# EAGLE design UPC v4 (EAGLE 7.6.0)
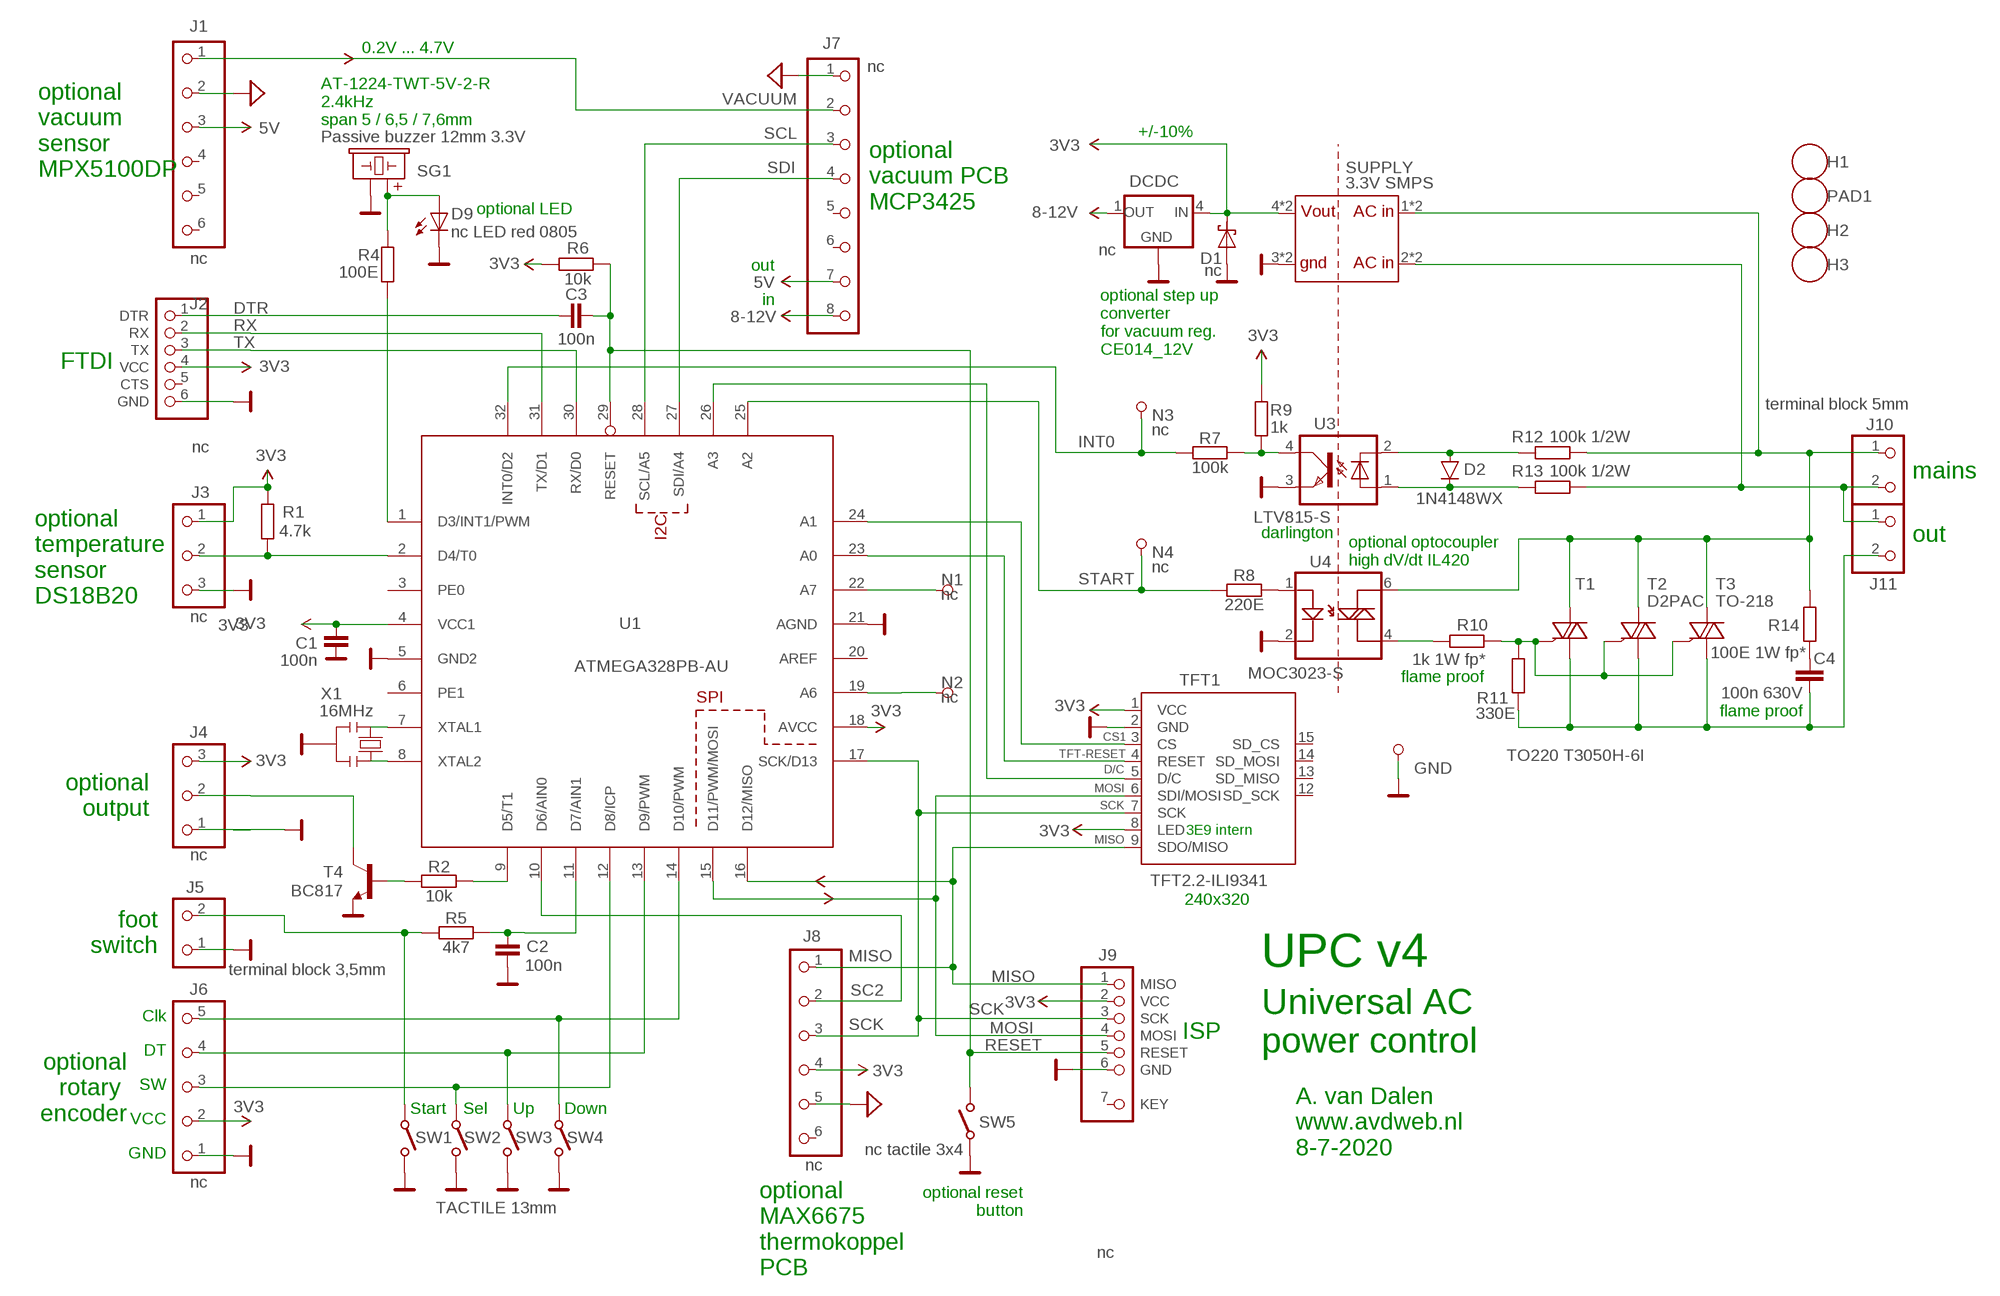
[diagram p0: schematic, sheet 1]
V1 (ARROW): VALUE: x
V2 (ARROW): VALUE: x
V3 (ARROW): VALUE: x
V4 (ARROW): VALUE: x
V5 (ARROW): VALUE: x
V6 (ARROW): VALUE: x
V7 (ARROW): VALUE: x
V8 (ARROW): VALUE: x
V9 (ARROW): VALUE: x
V10 (ARROW): VALUE: x
V11 (ARROW): VALUE: x
V12 (ARROW): VALUE: x
V13 (ARROW): VALUE: x
V14 (ARROW): VALUE: x
V15 (ARROW): VALUE: x
V16 (ARROW): VALUE: x
V17 (ARROW): VALUE: x
V18 (ARROW): VALUE: x
V19 (ARROW): VALUE: x
V20 (ARROW): VALUE: x

## Parts
C1  100n  SMD-C-0603-SMALL  [0603-SMALL]
C2  100n  SMD-C-0603-SMALL  [0603-SMALL]
C3  100n  SMD-C-0603-SMALL  [0603-SMALL]
C4  100n 630V  CAPX2  [C15B6]
D1  nc  TVS-DO-214AC  [DO-214AC]
D2  1N4148WX  DIODE-SMD  [SOD-323]
D9  nc LED red 0805  LEDCHIP-LED0805  [CHIP-LED0805]
DCDC  nc  78REGCE014-SMPS  [1X04-ACDC]
GND  GND  PIN  [PIN]
H1  HOLE3.6  [HOLE-3.6MM]
H2  HOLE3.6  [HOLE-3.6MM]
H3  HOLE3.6  [HOLE-3.6MM]
J1  nc  VACUUM-SENSORMPX5100  [MPX5100-VACUUM-SENSOR]
J2  nc  FTDI  [ZIGZAG-FTDI]
J3  nc  CON-3P2.54  [1X03]
J4  nc  CON-3P2.54  [1X03]
J5  terminal block 3,5mm  CON-2PSCR1  [SCREWTERMINAL-3.5MM-2]
J6  nc  CON-5PHEADER  [1X05]
J7  nc  CON-8P2,54  [1X08]
J8  nc  CON-6PISP-BOARD  [1X06-ISP-BOARD]
J9  nc  ISP'  [ZIGZAG-ISP]
J10  Terminal block 5mm 2p  CON-2PSCR2  [SCREWTERMINAL-5MM-2]
J11  terminal block 5mm  CON-2PSCR2  [SCREWTERMINAL-5MM-2]
N1  nc  PIN1.2MM  [PIN-1.2MM]
N2  nc  PIN1.2MM  [PIN-1.2MM]
N3  nc  PIN1.2MM  [PIN-1.2MM]
N4  nc  PIN1.2MM  [PIN-1.2MM]
PAD1  HOLE3.6  [HOLE-3.6MM]
R1  4.7k  SMD-R-0603-SMALL  [0603-SMALL]
R2  10k  SMD-R-0603-SMALL  [0603-SMALL]
R4  100E  SMD-R-0603-SMALL  [0603-SMALL]
R5  4k7  SMD-R-0603-SMALL  [0603-SMALL]
R6  10k  SMD-R-0603-SMALL  [0603-SMALL]
R7  100k  SMD-R-0603-SMALL  [0603-SMALL]
R8  220E  SMD-R-0603-SMALL  [0603-SMALL]
R9  1k  SMD-R-0603-SMALL  [0603-SMALL]
R10  1k 1W fp*  SMD-R-POWER  [0411/15_AVD]
R11  330E  SMD-R-0603-SMALL  [0603-SMALL]
R12  100k 1/2W  R-EU_M1206  [M1206]
R13  100k 1/2W  R-EU_M1206  [M1206]
R14  100E 1W fp*  SMD-R-POWER  [0411/15_AVD]
SG1  Passive buzzer 12mm 3.3V  BUZZER  [BUZZER-12MM-NS-KIT]
SUPPLY  3.3V SMPS  SMPSSMPS2  [SMPS2]
SW1  TACTILE 13mm  TACTILE  [TACTILE-PTH]
SW2  TACTILE 13mm  TACTILE  [TACTILE-PTH]
SW3  TACTILE 13mm  TACTILE  [TACTILE-PTH]
SW4  TACTILE 13mm  TACTILE  [TACTILE-PTH]
SW5  nc tactile 3x4  TACTILE"  [TACTILE-3X4]
T1  TO220 T3050H-6I  TRIACTO220  [TO220-SPOTWELDER]
T2  D2PAC  TRIACSMD  [D2PACK-SPOTWELDER-NO-CREAM]
T3  TO-218  TRIAC218  [TO218-SPOTWELDER]
T4  BC817  TRANSISTOR_NPNSOT23-3  [SOT23-3]
TFT1  TFT2.2-ILI9341  TFT2.2-9P9P  [TFT2.2-9P]
U1  ATMEGA328PB-AU  ATMEGA328PB-TQFP*  [TQFP32-08]
U3  LTV815-S  LTV816SMD  [DIL4-SMD]
U4  MOC3023-S  MOC3032-S  [DIL6-SMD-WIDE]
X1  16MHz  0011_CSTCE16M0V53-R0  [RESONATOR]

## Nets
3V3: C1.2 D1.C DCDC.4(IN) J2.4(VCC) J3.1 J4.3 J6.2 J8.4 J9.2(VCC) R1.1 R6.2 R9.2 SUPPLY.4(5V) SUPPLY.7(5V) TFT1.1(VCC) TFT1.8(LED) U1.4(VCC1) U1.18(AVCC)
5V: J1.3 J7.7
8-12V: DCDC.1(OUT) J7.8
AGND: J1.2 J7.1 J8.5
BUZZER: R4.2 U1.1(D3/INT1/PWM)
BUZZER+: D9.A R4.1 SG1.+1(+) SG1.+2(+)
CS1: TFT1.3(CS) U1.24(A1)
D/C: TFT1.5(D/C) U1.26(A3)
DOWN: J6.3 SW2.3(P) SW2.4(P) U1.12(D8/ICP)
DTR: C3.1 J2.1(DTR)
FOOT1: J5.2 R5.1 SW1.3(P) SW1.4(P)
FOOT2: C2.2 R5.2 U1.11(D7/AIN1)
GND: C1.1 C2.1 D1.A D9.C DCDC.2(GND) DCDC.3(GND) GND.1 J2.6(GND) J3.3 J4.1 J5.1 J6.1 J9.6(GND) SG1.-1(-) SG1.-2(-) SUPPLY.3(GND) SUPPLY.5(GND) SW1.1(O) SW1.2(O) SW2.1(O) SW2.2(O) SW3.1(O) SW3.2(O) SW4.1(O) SW4.2(O) SW5.2(P) T4.2(E) TFT1.2(GND) U1.5(GND2) U1.21(AGND) U3.3(EMIT) U4.2 X1.2 ; supply symbol labelled GND2
INT0: N3.1 R7.1 U1.32(INT0/D2)
MAINS1 [PWR]: J10.2 J11.1 R13.2 SUPPLY.2(AC2) SUPPLY.8(AC2)
MAINS2: J10.1 R12.2 R14.2 SUPPLY.1(AC1) SUPPLY.9(AC1) T1.2(A2) T2.TAB(A2) T3.2(A2) U4.6
MISO: J8.1 J9.1(MISO) TFT1.9(SDO/MISO) U1.16(D12/MISO)
MOSI: J9.4(MOSI) TFT1.6(SDI/MOSI) U1.15(D11/PWM/MOSI)
N$1: R10.1 U4.4
N$2: R2.1 T4.1(B)
N$3: N2.1 U1.19(A6)
N$4: N1.1 U1.22(A7)
N$5: R8.2 U4.1
N$6: D2.A R12.1 U3.2(C)
N$7: D2.C R13.1 U3.1(A)
N$8: U1.7(XTAL1) X1.1
N$9: C4.1 R14.1
N$10: J4.2 T4.3(C)
N$11: R2.2 U1.9(D5/T1)
N$13: R7.2 R9.1 U3.4(COL)
N$17: U1.8(XTAL2) X1.3
Q1-C: C4.2 C4.3 J11.2 R11.1 T1.1(A1) T2.1(A1) T3.1(A1)
Q1-G: R10.2 R11.2 T1.3(G) T2.3(G) T3.3(G)
RESET: C3.2 J9.5(RESET) R6.1 SW5.1(O) U1.29(RESET)
RX: J2.2(RX) U1.31(TX/D1)
SC2: J8.2 U1.10(D6/AIN0)
SCK: J8.3 J9.3(SCK) TFT1.7(SCK) U1.17(SCK/D13)
SCL: J7.3 U1.28(SCL/A5)
SDI: J7.4 U1.27(SDI/A4)
SEL: J6.5 SW4.3(P) SW4.4(P) U1.14(D10/PWM)
START: N4.1 R8.1 U1.25(A2)
TEMP: J3.2 R1.2 U1.2(D4/T0)
TFT-RESET: TFT1.4(RESET) U1.23(A0)
TX: J2.3(TX) U1.30(RX/D0)
UP: J6.4 SW3.3(P) SW3.4(P) U1.13(D9/PWM)
VACUUM: J1.1 J7.2
Unconnected: J1.4 J1.5 J1.6 J2.5(CTS) J7.5 J7.6 J8.6 J9.7(KEY) TFT1.12(SD_SCK) TFT1.13(SD_MISO) TFT1.14(SD_MOSI) TFT1.15(SD_CS) U1.3(PE0) U1.6(PE1) U1.20(AREF)

## Notes on the sheet
- 0.2V ... 4.7V
- AT-1224-TWT-5V-2-R
  2.4kHz
  span 5 / 6,5 / 7,6mm
- +/-10%
- optional
  vacuum 
  sensor
  MPX5100DP
- optional LED
- optional
  vacuum PCB
  MCP3425
- out
- in
- optional step up
  converter
  for vacuum reg.
  CE014_12V
- FTDI
- mains
- darlington | out
- optional optocoupler
  high dV/dt IL420
- optional
  temperature 
  sensor
  DS18B20
- flame proof
- flame proof
- optional
  output
- 3E9 intern
- 240x320
- foot
  switch
- UPC v4
- Clk
- ISP
- optional
  rotary 
  encoder
- Universal AC 
  power control
- DT
- SW
- Start | Sel | Up | Down
- VCC
- A. van Dalen
  www.avdweb.nl
  8-7-2020
- GND
- optional reset
  button
- optional
  MAX6675 
  thermokoppel 
  PCB

## Library data of the parts
C1-C3 = Albert:SMD-C: Capacitors ...4.7uF @ 6.3V -> 0402 ...10uF @ 16V -> 0603 ...22uF @ 25V -> 0805
C4 = Albert:CAP: CAP-11378
D1 = Albert:TVS: DIODE uni and bidirectional supressor diode
D2 = Albert:DIODE-SMD
D9 = led:LED: LED OSRAM: - CHIPLED LG R971, LG N971, LY N971, LG Q971, LY Q971, LO R971, LY R971 LH N974, LH R974 LS Q976, LO Q976, LY Q976 LO Q996 - Hyper CHIPLED LW Q18S LB Q993, LB Q99A, LB R99A - SideLED LS A670, LO A670, LY A670, LG A670, LP A670 LB A673, LV A673, LT A673, LW A673 LH A674 LY A675 LS A676, LA A676, LO A676, LY A676, LW A676 LS A679, LY A679, LG A679 - Hyper Micro SIDELED® LS Y876, LA Y876, LO Y876, LY Y876 LT Y87S - SmartLED LW L88C, LW L88S LB L89C, LB L89S, LG L890 LS L89K, LO L89K, LY L89K LS L896, LA L896, LO L896, LY L896 - TOPLED LS T670, LO T670, LY T670, LG T670, LP T670 LSG T670, LSP T670, LSY T670, LOP T670, LYG T670 LG T671, LOG T671, LSG T671 LB T673, LV T673, LT T673, LW T673 LH T674 LS T676, LA T676, LO T676, LY T676, LB T676, LH T676, LSB T676, LW T676 LB T67C, LV T67C, LT T67C, LS T67K, LO T67K, LY T67K, LW E67C LS E67B, LA E67B, LO E67B, LY E67B, LB E67C, LV E67C, LT E67C LW T67C LS T679, LY T679, LG T679 LS T770, LO T770, LY T770, LG T770, LP T770 LB T773, LV T773, LT T773, LW T773 LH T774 LS E675, LA E675, LY E675, LS T675 LS T776, LA T776, LO T776, LY T776, LB T776 LHGB T686 LT T68C, LB T68C - Hyper Mini TOPLED® LB M676 - Mini TOPLED Santana® LG M470 LS M47K, LO M47K, LY M47K Source: http://www.osram.convergy.de LUXEON: - LUMILED® LXK2-PW12-R00, LXK2-PW12-S00, LXK2-PW14-U00, LXK2-PW14-V00 LXK2-PM12-R00, LXK2-PM12-S00, LXK2-PM14-U00 LXK2-PE12-Q00, LXK2-PE12-R00, LXK2-PE12-S00, LXK2-PE14-T00, LXK2-PE14-U00 LXK2-PB12-K00, LXK2-PB12-L00, LXK2-PB12-M00, LXK2-PB14-N00, LXK2-PB14-P00, LXK2-PB14-Q00 LXK2-PR12-L00, LXK2-PR12-M00, LXK2-PR14-Q00, LXK2-PR14-R00 LXK2-PD12-Q00, LXK2-PD12-R00, LXK2-PD12-S00 LXK2-PH12-R00, LXK2-PH12-S00 LXK2-PL12-P00, LXK2-PL12-Q00, LXK2-PL12-R00 Source: www.luxeon.com KINGBRIGHT: KA-3528ASYC Source: www.kingbright.com
DCDC = Albert:78REG
GND N1-N4 = Albert:PIN: PIN HEADER
H1-H3 PAD1 = Albert:HOLE
J1 = Albert:VACUUM-SENSOR
J2 = Albert:FTDI
J3 J4 = Albert:CON-3P
J5 J10 J11 = Albert:CON-2P
J6 = Albert:CON-5P
J7 = Albert:CON-8P
J8 = Albert:CON-6P
J9 = Albert:ISP
R1 R2 R4-R11 R14 = Albert:SMD-R: Resistors all kinds in 0603 and 0402
R12 R13 = rcl:R-EU_: RESISTOR, European symbol
SG1 = Albert:BUZZER
SUPPLY = Albert:SMPS
SW1-SW5 = Albert:TACTILE
T1-T3 = Albert:TRIAC: THYRISTOR
T4 = SparkFun-DiscreteSemi:TRANSISTOR_NPN: Generic NPN BJT MMBT2222A - TRANS-08049 (SOT-23, 1A 40V) MPSA42 - TRANS-09116 (SOT-23, 500mA 300V) MMBT5088LT1G - TRANS-11160 (SOT-23, 50 mA 30V) BC547 - COM-08928 <http://www.sparkfun.com/products/8928> (TO-92 45V 100mA) (1.Collector 2.Base 3.Emitter) 2N3904 - COM-00521 <http://www.sparkfun.com/products/521> (TO-92 40V 200mA) (1.Emitter 2.Base 3.Collector) P2N2222A - COM-12852 <http://www.sparkfun.com/products/12852> (TO-92 40V 600mA) (1.Collector 2.Base 3.Emitter); PROD_ID: TRANS-08049
TFT1 = Albert:TFT2.2-9P
U1 = Albert-Arduino:ATMEGA328PB-TQFP: MICROCONTROLLER 4 Kbytes FLASH 128 bytes SRAM 256 bytes EEPROM UART 6-channel 10 bit ADC
U3 = Albert:LTV816: OPTO COUPLER Source: LITEON, LTV816.pdf
U4 = Albert:MOC3032: Opto-isolated TRIAC
X1 = Cristalli:0011_CSTCE16M0V53-R0: 16Mhz - SMD; MONTHLY_USAGE: _____; PART_NUMBER: CSTCE16M0V53-R0; PRICE: _____; SUPPLIER: _____; TYPE: Cristalli; VALUE: CSTCE16M0V53-R0

## Net classes
1 PWR: width 0.406 mm
2 GND: width 0.406 mm

## Board
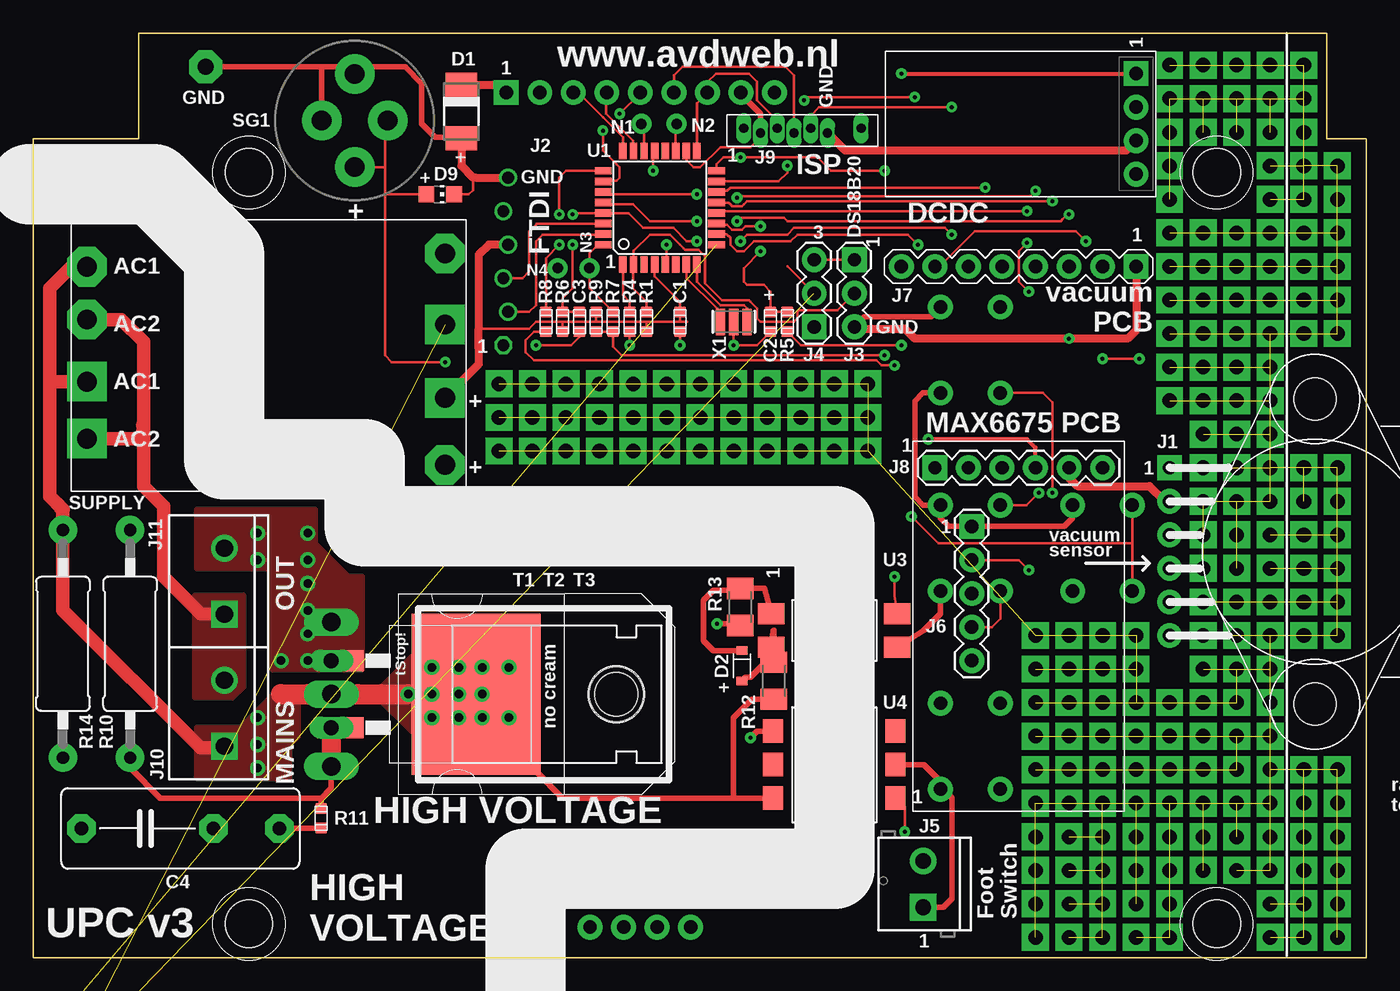
[diagram p1: board, top side]
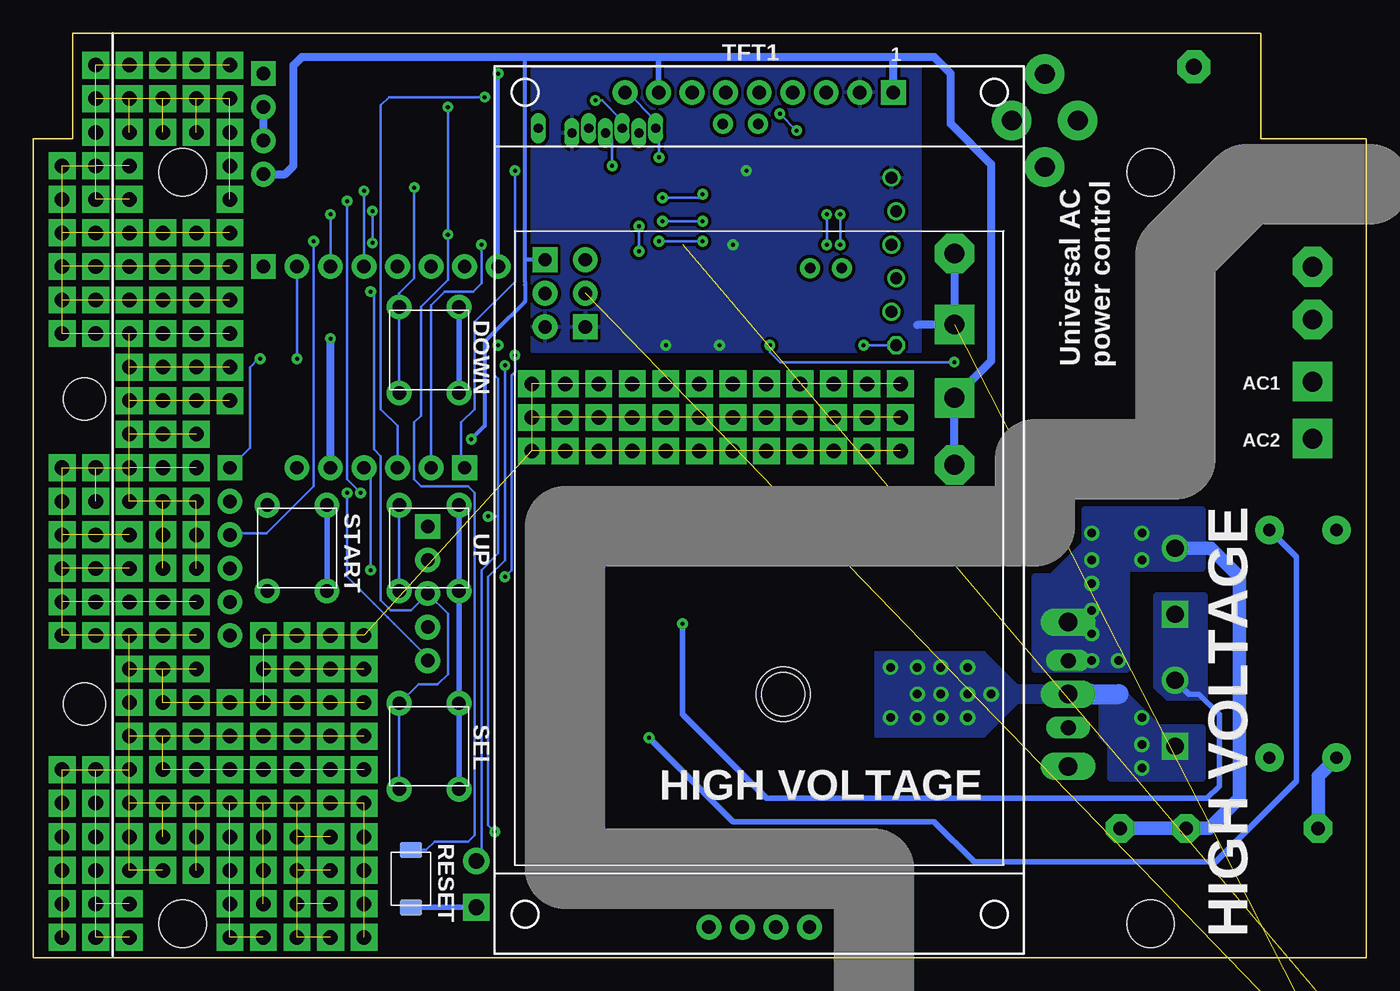
[diagram p2: board, bottom side, seen from below]

Size 101 x 70 mm. Coordinates in mm from the lower left corner, seen from the top.
Outline: 98,70 8,70 8,62 0,62 0,0 8,0 98,0 101,0 101,62 98,62 98,70
Copper layers (1*16): Top 0.035mm / dielectric 1.5mm / Bottom 0.035mm
Design rules "Albert 5mil": minimum track width 5mil, minimum drill 0.3mm, track to track 5mil, track to pad 5mil, pad to pad 5mil, via to via 5mil, smd to smd 5mil, copper to edge 10mil, drill to drill 8mil, minimum pad ring 8.5mil, minimum via ring 10mil, stop-mask expansion 4mil, vias tented up to drill 25mil, thermal gap 10mil
tRestrict: 9 lines
bRestrict: 9 lines

### Footprints (pad centres in the part's own frame; a part is rotated, then mirrored left to right if it is on the bottom)
0603-SMALL = smd 0.9 x 0.8: 1 0,0.75; 2 0,-0.75
C15B6 = drill 1.016 pad 2.159 octagon: 1 -7.5,0; 2 7.5,0; 3 2.5,0
DO-214AC = smd 1.8 x 2.4: A 2.025,0; C -2.025,0
SOD-323 = smd 0.63 x 0.83: A 1.15,0; C -1.15,0
CHIP-LED0805 = smd 1.2 x 1.2: A 0,-1.05; C 0,1.05
1X04-ACDC = drill 1.016 pad 1.88 square: 1 -3.81,0 | drill 1.016 pad 1.88: 2 -1.27,0; 3 1.27,0; 4 3.81,0
PIN = drill 1.2 pad 2.5 octagon: 1 0,0
HOLE-3.6MM = hole 3.6: 0,0
MPX5100-VACUUM-SENSOR = drill 1.016 pad 1.88 square: 1 -6.35,0 | drill 1.016 pad 1.88: 2 -3.81,0; 3 -1.27,0; 4 1.27,0; 5 3.81,0; 6 6.35,0 | hole 3.2: 11.55,11; -11.55,11
ZIGZAG-FTDI = drill 0.9 octagon: 1 0,0.177 | drill 0.9: 2 2.54,-0.177; 3 5.08,0.177; 4 7.62,-0.177; 5 10.16,0.177; 6 12.7,-0.177
1X03 = drill 1.016 pad 1.88 square: 1 0,0 | drill 1.016 pad 1.88: 2 2.54,0; 3 5.08,0
SCREWTERMINAL-3.5MM-2 = drill 1.2 pad 2.032 square: 1 0,0 | drill 1.2 pad 2.032: 2 3.5,0
1X05 = drill 1.016 pad 1.88 square: 1 0,0 | drill 1.016 pad 1.88: 2 2.54,0; 3 5.08,0; 4 7.62,0; 5 10.16,0
1X08 = drill 1.016 pad 1.88 square: 1 0,0 | drill 1.016 pad 1.88: 2 2.54,0; 3 5.08,0; 4 7.62,0; 5 10.16,0; 6 12.7,0; 7 15.24,0; 8 17.78,0
1X06-ISP-BOARD = drill 1.016 pad 1.88 square: 1 -6.35,0 | drill 1.016 pad 1.88: 2 -3.81,0; 3 -1.27,0; 4 1.27,0; 5 3.81,0; 6 6.35,0
ZIGZAG-ISP = drill 0.7 pad 1.143 long: 1 0,0.178; 2 1.27,-0.178; 3 2.54,0.178; 4 3.81,-0.178; 5 5.08,0.178; 6 6.35,-0.178; 7 8.89,0.178
SCREWTERMINAL-5MM-2 = drill 1.3 pad 2.032 square: 1 0,0 | drill 1.3 pad 2.032: 2 5,0
PIN-1.2MM = drill 0.8 pad 1.524: 1 0,0
0411/15_AVD = drill 0.914 pad 2.159: 1 -8.62,0; 2 8.62,0
M1206 = smd 1.6 x 2: 1 -1.4,0; 2 1.4,0
BUZZER-12MM-NS-KIT = drill 1.5 pad 3: +1 3.525,0; +2 0,2.5; -1 -3.525,0; -2 0,-2.5
SMPS2 = drill 1.5 pad 3 octagon: 1 1.18,17; 2 1.18,13; 4 28.3,2; 5 28.3,18 | drill 1.5 pad 3 square: 3 28.3,12.62; 7 28.3,7.07; 8 1.18,3.98; 9 1.18,8.3
TACTILE-PTH = drill 1.016 pad 1.88: 1 -3.251,2.261; 2 3.251,2.261; 3 -3.251,-2.261; 4 3.251,-2.261
TACTILE-3X4 = smd 1.15 x 1.7: 1 -2.175,0; 2 2.175,0
TO220-SPOTWELDER = drill 1.118 long: 1 -2.54,0; 2 0,0; 3 2.54,0 | hole 3.302: 0,21.59
D2PACK-SPOTWELDER-NO-CREAM = smd 1.6 x 3.5: 1 -2.54,-8.275; 3 2.54,-8.275 | smd 12.2 x 9.75: TAB 0,2
TO218-SPOTWELDER = drill 1.397 long: 1 -5.461,0; 2 0,0; 3 5.461,0 | hole 4.115: 0,21.59
SOT23-3 = smd 0.8 x 0.9: 1 -0.95,-1; 2 0.95,-1; 3 0,1.1
TFT2.2-9P = drill 1.016 pad 1.88 square: 1 0,10.16 | drill 1.016 pad 1.88: 2 0,7.62; 3 0,5.08; 4 0,2.54; 5 0,0; 6 0,-2.54; 7 0,-5.08; 8 0,-7.62; 9 0,-10.16; 12 63.2,3.81; 13 63.2,1.27; 14 63.2,-1.27; 15 63.2,-3.81
TQFP32-08 = smd 1.27 x 0.559: 1 -4.293,2.8; 2 -4.293,2; 3 -4.293,1.2; 4 -4.293,0.4; 5 -4.293,-0.4; 6 -4.293,-1.2; 7 -4.293,-2; 8 -4.293,-2.8; 17 4.293,-2.8; 18 4.293,-2; 19 4.293,-1.2; 20 4.293,-0.4; 21 4.293,0.4; 22 4.293,1.2; 23 4.293,2; 24 4.293,2.8 | smd 0.559 x 1.27: 9 -2.8,-4.293; 10 -2,-4.293; 11 -1.2,-4.293; 12 -0.4,-4.293; 13 0.4,-4.293; 14 1.2,-4.293; 15 2,-4.293; 16 2.8,-4.293; 25 2.8,4.293; 26 2,4.293; 27 1.2,4.293; 28 0.4,4.293; 29 -0.4,4.293; 30 -1.2,4.293; 31 -2,4.293; 32 -2.8,4.293
DIL4-SMD = smd 1.6 x 2: 1 -1.27,-4.77; 2 1.27,-4.77; 3 1.27,4.77; 4 -1.27,4.77
DIL6-SMD-WIDE = smd 1.78 x 1.52: 1 -2.54,-4.645; 2 0,-4.645; 3 2.54,-4.645; 4 2.54,4.645; 5 0,4.645; 6 -2.54,4.645
RESONATOR = smd 0.7 x 2: 1 -1,0; 2 0,0; 3 1,0

### Placement (x,y rotation side)
C1  49.01,48.13 180 top
C2  55.86,48.13 180 top
C3  41.39,48.13 180 top
C4  11.16,9.78 0 top
D1  32.45,64.06 270 top
D2  53.7,22.1 270 top
D9  30.84,57.79 270 top
DCDC  83.55,63.12 270 top
GND  13.07,67.44 0 top
H1  89.65,59.45 90 top
H2  16.35,2.55 90 top
H3  16.35,59.45 90 top
J1  86.09,30.73 270 top
J2  35.8,46.36 90 top
J3  62.21,52.83 270 top
J4  59.17,47.75 90 top
J5  67.42,3.81 90 top
J6  71.1,32.64 270 top
J7  83.55,52.33 180 top
J8  74.66,37.09 0 top
J9  53.83,62.61 0 top
J10  14.5,16 90 top
J11  14.5,26 90 top
N1  46.09,63.12 0 top
N2  48.75,63.12 0 top
N3  42.15,52.2 0 top
N4  39.73,52.2 0 top
PAD1  89.65,2.55 90 top
R1  46.47,48.13 180 top
R2  -5.6,-12.83 0 top  (outside the outline)
R4  45.2,48.13 180 top
R5  57.13,48.13 180 top
R6  40.12,48.13 0 top
R7  43.93,48.13 0 top
R8  38.85,48.13 0 top
R9  42.66,48.13 180 top
R10  7.35,23.75 270 top
R11  21.83,10.54 180 top
R12  56.12,20.96 270 top
R13  53.58,26.54 270 top
R14  2.27,23.75 90 top
SG1  24.37,63.37 270 top
SUPPLY  2.91,35.31 0 top
SW1  81,31 270 bottom
SW2  71,16 270 bottom
SW3  71,31 270 bottom
SW4  71,46 270 bottom
SW5  72.37,5.97 270 bottom
T1  22.59,19.94 270 top
T2  31.56,19.94 270 top
T3  22.59,19.94 270 top
T4  -1.79,-13.84 0 top  (outside the outline)
TFT1  46,65.5 270 bottom
U1  47.48,56.77 90 top
U3  60.69,24.77 270 top
U4  60.69,14.61 90 top
X1  53.07,48.13 0 top

### Tracks (layer width: path | path; a pad name or v marks a point on that pad's centre or on a via)
3V3  (via drill 0.3)
  Top 0.203: 46.47,48.13 42.66,48.13 | 42.66,48.13 40.12,48.13 | 40.12,48.13 38.85,48.13 38.08,48.13 37.58,47.63 33.77,47.63 | R1.1 46.47,48.13 | R9.2 42.66,48.13 | 46.47,48.13 49.01,48.13 | 49.01,48.13 49.26,48.13 49.53,48.13 | 49.01,48.13 C1.2 49.01,49.66 47.08,51.58 U1.4 | R6.2 40.12,48.13 | J9.2 55.1,62.1 54.34,61.34 52.05,61.34 50.53,59.82 50.02,59.82 49.48,60.36 U1.18 | J6.2 74.66,30.1 v75.42,29.34 | J4.3 J3.1
  Top 0.305: J8.4 75.93,38.61 75.3,39.24 v67.8,39.24
  Top 0.406: TFT1.8 53.62,65.36 55.1,63.88 J9.2
  Top 0.61: J2.4 34.53,53.98 33.77,53.21 33.77,51.44 33.77,47.63 33.77,46.1 33.77,45.45 33.77,44.94 SUPPLY.7 | D1.C 35.25,66.09 TFT1.1
  Bottom 0.203: J8.4 75.42,36.58 v75.42,29.34
  Bottom 0.305: 63.74,52.71 63.74,51.18 63.74,50.93 63.74,49.66 66.02,47.37 66.79,46.61 66.79,40.26 v67.8,39.24 | 63.74,52.71 63.74,67.95 63.99,68.2 | J3.1 63.74,52.83 63.74,52.71
  Bottom 0.406: TFT1.8 53.62,68.16 53.58,68.2
  Bottom 0.61: DCDC.4 81.9,59.31 81.26,59.94 81.26,66.93 81.26,67.56 80.63,68.2 64.5,68.2 63.99,68.2 61.2,68.2 53.58,68.2 35.8,68.2 | 35.8,68.2 32.75,68.2 31.48,66.93 31.48,63.12 28.43,60.07 28.43,46.17 28.43,45.66 28.43,45.15 SUPPLY.7 SUPPLY.4 | TFT1.1 35.84,68.16 35.8,68.2
5V  (via drill 0.3)
  Top 0.203: J7.7 68.69,52.33 71.36,54.99 78.98,54.99 v79.74,54.23
  Bottom 0.203: v79.74,54.23 79.74,53.72 79.74,50.04 79.74,39.5 79.74,36.32 79.74,35.69 83.3,32.13 85.96,32.13 J1.3
8-12V  (via drill 0.3)
  Top 0.305: v65.77,66.93 DCDC.1
  Bottom 0.305: J7.8 v65.77,66.93
AGND  (via drill 0.3)
  Top 0.61: J8.5 78.47,36.32 79.11,35.69 84.57,35.69 85.71,34.55 J1.2 | J7.1 83.55,47.5 82.92,46.86 v78.47,46.86 66.79,46.86 66.28,47.37 66.02,47.63 62.21,47.63
  Bottom 0.61: J8.5 v78.47,46.86
BUZZER
  Top 0.203: U1.1 44.68,50.17 45.2,49.66 R4.2
BUZZER+  (via drill 0.3)
  Top 0.203: 26.65,57.79 26.65,57.28 | 26.65,57.28 26.65,47.63 26.65,46.61 26.65,45.59 27.16,45.09 v31.23,45.09 | v45.2,46.36 R4.1 | 26.65,59.82 26.65,57.79 | 26.65,57.79 26.65,57.28 | 26.65,60.36 26.65,59.82 | 26.65,59.82 26.65,63.16 SG1.+2 | SG1.+1 26.62,59.85 26.65,59.82 | D9.A 26.65,57.79
  Bottom 0.203: v45.2,46.36 45.2,45.85 44.43,45.09 34.27,45.09 33.51,45.09 v31.23,45.09
CS1
  Top 0.203: U1.24 44.69,61.98 44.69,62.1 43.16,63.63 41.39,65.41 41.29,65.5 TFT1.3
D/C  (via drill 0.3)
  Top 0.203: TFT1.5 46,65.45 v44.43,63.88 | v43.16,62.61 43.16,61.09 44.18,60.07 44.43,59.82 44.43,59.06 44.18,58.8 43.22,58.8 U1.26
  Bottom 0.203: v44.43,63.88 v43.16,62.61
DOWN  (via drill 0.3)
  Top 0.203: v75.3,56.52 54.09,56.52 51.92,56.52 | 51.92,56.52 U1.12 51.92,56.52 | v75.42,50.42 74.66,51.18 74.66,53.47 v75.3,54.1
  Bottom 0.203: SW2.4 SW2.3 71.81,20.7 70.34,20.7 69.58,21.46 69.58,25.78 69.58,26.04 J6.3 72.37,26.29 73.9,26.29 74.66,27.05 74.66,36.32 74.66,37.97 75.17,38.48 75.17,39.24 75.17,48.9 75.17,50.17 75.17,50.42 v75.42,50.42 | v75.3,54.1 75.3,56.26 v75.3,56.52
DTR  (via drill 0.3)
  Top 0.203: C3.1 41.39,46.99 40.75,46.36 v38.08,46.36
  Bottom 0.203: J2.1 37.83,46.36 v38.08,46.36
FOOT1  (via drill 0.3)
  Top 0.203: v65.77,46.36 59.04,46.36 58.16,46.36 R5.1 | SW1.4 83.26,31.37 | SW1.3 83.26,31.37 | v66.53,33.4 68.56,31.37 80.25,31.37 83.26,31.37
  Bottom 0.203: 67.04,28.32 67.04,28.83 | 67.04,28.83 67.04,29.34 65.77,30.61 65.77,31.12 65.77,31.37 65.77,33.4 | 65.77,33.4 65.77,39.75 65.77,43.82 66.02,44.07 66.02,45.34 66.02,46.1 v65.77,46.36 | J5.2 67.04,7.69 67.04,28.83 | v66.53,33.4 65.77,33.4
FOOT2  (via drill 0.3)
  Top 0.203: C2.2 R5.2 | 55.86,48.64 C2.2 | C2.2 55.86,49.66 55.86,50.42 55.36,50.93 54.09,50.93 53.83,51.18 53.83,52.2 v55.1,53.47 | U1.11 51.84,55.5 52.56,55.5 52.94,55.12 53.7,55.12 53.96,55.37 v55.1,55.37
  Bottom 0.203: v55.1,55.37 v55.1,53.47
GND  (via drill 0.3, 0.3 pad 0.41)  (1 unrouted)
  Top 0.203: U1.5 47.99,52.59 v47.99,53.98 | X1.2 v53.07,46.36 54.09,46.36 54.84,46.36 C2.1 | C1.1 v49.01,46.36 | U1.21 46.97,60.95 v46.97,59.56 | 69.37,32.64 J6.1 | 31.99,57.79 D9.C 33,57.79 33.33,58.11 33.33,59.06
  Top 0.406: U3.3 67.47,24.77 68.74,26.04 SW3.2 | SW4.2 67.42,42.75 66.79,42.11 66.79,36.2 66.79,34.89 67.42,34.25 SW3.1 68.74,33.27 69.37,32.64 J6.1 74.66,32.64 78.1,32.64 78.74,33.27 SW1.1 | U4.2 67.47,14.61 68.74,13.34 SW2.2 68.94,12.75 69.58,12.11 69.58,11.05 69.58,4.45 68.94,3.81 J5.1 | J3.3 62.98,48.52 68,48.52 SW4.1 | D1.A 32.38,62.1 30.46,62.1 29.45,63.12 29.45,66.17 28.21,67.41 28.18,67.44 24.37,67.44 | 21.83,67.44 24.08,67.44 24.37,67.44 | 21.83,67.44 GND.1 | SG1.-2 21.87,67.4 21.83,67.44 | SG1.-1 24.37,67.44
  Top 0.61: J9.6 61.53,61.09 82.79,61.09 DCDC.3 | J2.6 33.51,59.06 33.33,59.06 32.45,59.94 D1.A
  Bottom 0.406: SW2.2 SW2.1 SW3.2 SW3.1 | SW1.2 SW1.1 | SW4.2 SW4.1 | SW5.2 67.44,3.79 J5.1
  Bottom 0.61: DCDC.2 DCDC.3 | SUPPLY.5 SUPPLY.3 33.97,47.93 34.02,47.88
  pour Bottom (isolate 0.254): 33.77,67.44 33.77,45.85 63.23,45.85 63.23,67.44
INT0
  Top 0.203: N3.1 42.15,52.93 42.15,53.34 42.78,53.97 U1.32 | N3.1 42.15,51.94 | 42.15,51.94 42.15,50.67 43.93,48.9 R7.1 | N3.1 42.15,51.94
MAINS1  (via drill 0.3)
  Top 0.406: R13.2 53.45,25.27 v51.8,25.27
  Top 1.016: J11.1 12.68,26.04 9.89,28.83 9.89,32.13 | 9.89,32.13 9.89,32.64 | 9.89,32.64 9.89,32.13 | 9.89,32.64 9.89,34.16 8.37,35.69 8.37,39.24 | 8.37,39.24 8.37,39.75 | 8.37,39.75 8.37,40.26 | 8.37,40.26 8.37,43.05 8.37,46.61 6.67,48.31 SUPPLY.2 | 8.32,40.3 8.37,40.26 | 8.32,39.8 8.37,39.75 | SUPPLY.8 8.32,39.29 8.37,39.24
  Bottom 0.406: J10.2 13.44,19.94 12.68,19.94 11.16,18.42 11.16,12.98 12.08,12.07 19.8,12.07 | 19.8,12.07 20.05,12.07 | 19.8,12.07 36.81,12.07 45.45,12.07 51.8,18.42 v51.8,25.27
  pour Top (no thermals): 12.3,27.4 15.9,27.4 15.9,20.5 15.1,19.7 13.4,19.7 12.3,19.7
  pour Bottom (no thermals): 12.3,27.4 15.9,27.4 15.9,20.5 15.1,19.7 13.4,19.7 12.3,19.7
MAINS2  (via drill 0.64)
  Top 0.406: v36.05,18.16 36.11,17.96 36.11,15.06 37.07,14.1 38.08,14.1 40.12,12.07 53.07,12.07 | 35.41,19.56 v34.02,18.16 | 55.1,12.07 55.61,12.07 U4.6 53.07,12.07 | R12.2 54.46,19.56 53.07,18.16 53.07,12.07
  Top 1.016: J10.1 14.46,15.88 12.68,15.88 2.27,26.29 R14.2 2.27,33.91 1.76,34.42 1.25,34.93 1.25,43.31 | 1.25,43.31 1.25,44.32 1.25,50.67 2.78,52.2 3.98,52.2 SUPPLY.1 | SUPPLY.9 1.55,43.61 1.25,43.31
  Top 1.524: 18.78,19.94 20.81,19.94 T3.2 24.62,19.94 26.4,19.94 v28.43,19.94
  Bottom 1.524: T3.2 20.81,19.94 18.78,19.94
  other vias: 17,18.16 17,16.13 17,14.35 30.21,19.94 32.24,19.94 34.02,19.94 36.05,21.97 34.02,21.97 32.24,21.97 30.21,21.97 30.21,18.16 32.24,18.16
  pour Top (no thermals): 12.43,17.4 15.73,17.4 18.65,20.32 20.05,20.32 20.05,16.77 19.41,16.13 19.41,13.59 12.43,13.59
  pour Top (no thermals): 25.89,19.94 28.94,22.99 28.94,16.89
  pour Bottom (no thermals): 12.43,17.4 15.73,17.4 18.65,20.32 20.05,20.32 20.05,16.77 19.41,16.13 19.41,13.59 12.43,13.59
  pour Bottom (no thermals): 21.95,20.57 26.4,20.57 28.94,23.11 37.2,23.11 37.2,16.77 28.94,16.77 26.4,19.3 21.95,19.3
MISO  (via drill 0.3)
  Top 0.203: U1.16 51.77,60.05 52.31,60.58 v53.58,60.58 59.42,60.58 60.44,59.56 60.94,59.56 v64.5,59.56
  Bottom 0.203: J8.1 68.56,37.34 68.56,40.51 67.55,41.53 67.55,43.56 67.55,48.13 64.5,51.18 64.5,51.31 v64.5,59.56 | TFT1.9 55.96,65.5 53.83,63.37 J9.1 53.58,62.54 v53.58,60.58
MOSI  (via drill 0.3)
  Top 0.203: 52.53,58.77 U1.15 56.47,58.77 57.13,59.44 v57.13,59.94 | TFT1.6 48.54,66.8 49.17,67.44 57.01,67.44 57.64,66.8 J9.4
  Bottom 0.203: J9.4 57.13,61.93 v57.13,59.94
N$1  (via drill 0.3)
  Top 0.406: U4.4 54.85,17.15 v54.34,16.64
  Bottom 0.406: v54.34,16.64 47.99,10.29 47.48,10.29 32.75,10.29 29.7,7.24 11.41,7.24 10.91,7.75 5.32,13.34 5.32,13.84 5.32,30.35 7.35,32.39 R10.1
N$2  (1 unrouted)
N$3
  Top 0.203: U1.19 48.68,63.05 N2.1
N$4
  Top 0.203: U1.22 46.28,62.92 N1.1
N$5  (via drill 0.3)
  Top 0.203: 65.26,11.99 U4.1 66.02,11.38 v66.02,9.53 | v65.26,44.83 64.25,44.83 63.87,45.21 39.48,45.21 37.96,45.21 37.32,45.85 37.32,46.36 37.32,46.75 37.96,47.38 R8.2
  Bottom 0.203: v65.26,44.83 65.26,44.32 65.26,41.28 65.26,30.35 65.26,30.1 66.53,28.83 66.53,28.07 66.53,20.7 66.53,16.89 66.53,11.3 66.53,10.03 v66.02,9.53
N$6
  Top 0.305: U3.2 56.12,24.77
  Top 0.406: 56.04,24.76 U3.2 | 56.12,24.77 R12.1 55.49,22.36 54.34,21.21 53.97,21.21 D2.A
N$7
  Top 0.406: U3.1 55.41,27.94 R13.1 53.45,27.81 51.55,27.81 50.78,27.05 50.78,24 51.55,23.24 51.8,23.24 D2.C
N$8
  Top 0.203: U1.7 49.51,52.45 49.51,51.44 51.8,49.15 51.8,48.4 X1.1
N$9
  Bottom 1.016: C4.1 3.66,13.72 3.66,13.74 R14.1
N$10  (1 unrouted)
  Top 0.203: 57.13,52.33 J4.2
N$11  (1 unrouted)
N$13  (via drill 0.3)
  Top 0.203: U3.4 65.26,27.38 v65.26,28.83 | R9.1 R7.2 43.93,46.23 44.56,45.59 v64.5,45.59
  Bottom 0.203: v65.26,28.83 64.75,29.34 64.75,41.28 64.75,43.56 | 64.75,43.56 64.75,44.07 | 64.75,43.56 64.75,44.07 | 64.75,44.07 64.5,44.32 v64.5,45.59
N$17
  Top 0.203: 50.31,52.45 U1.8 50.28,51.18 52.05,49.4 53.83,49.4 54.09,49.15 54.09,48.9 54.09,48.15 X1.3
NC1  (via drill 1.1 pad 2.03)  (206 unrouted)
  other vias: 75.93,4.06 75.93,6.61 75.93,9.14 75.93,1.53 98.79,11.68 96.25,11.68 93.71,11.68 81.01,4.06 81.01,6.61 81.01,9.14 81.01,1.53 83.55,6.61 86.09,11.68 88.63,11.68 91.17,11.68 81.01,11.68 78.47,11.68 75.93,11.68 83.55,11.68 86.09,14.23 88.63,14.23 91.17,14.23 81.01,14.23 78.47,14.23 83.55,14.23 86.09,16.77 88.63,16.77 91.17,16.77 81.01,16.77 78.47,16.77 93.71,16.77 83.55,16.77 86.09,1.53 86.09,4.06 96.25,1.53 96.25,4.06 83.55,1.53 83.55,4.06 93.71,4.06 93.71,1.53 93.71,9.14 88.63,9.14 86.09,9.14 83.55,9.14 91.17,6.61 88.63,6.61 86.09,6.61 93.71,6.61 91.17,9.14 96.25,6.61 96.25,9.14 98.79,6.61 98.79,9.14 98.79,1.53 98.79,4.06 78.47,4.06 78.47,6.61 78.47,9.14 78.47,1.53 98.79,14.23 96.25,14.23 93.71,14.23 86.09,19.3 88.63,19.3 91.17,19.3 81.01,19.3 78.47,19.3 75.93,19.3 75.93,21.84 78.47,21.84 81.01,21.84 83.55,21.84 83.55,24.38 81.01,24.38 78.47,24.38 75.93,24.38 88.63,21.84 91.17,21.84 93.71,19.3 93.71,21.84 83.55,19.3 98.79,24.38 93.71,24.38 91.17,24.38 88.63,24.38 96.25,24.38 98.79,26.92 93.71,26.92 91.17,26.92 88.63,26.92 88.63,29.47 88.63,32.01 96.25,26.92 98.79,29.47 96.25,29.47 98.79,32.01 96.25,32.01 98.79,34.55 96.25,34.55 93.71,34.55 91.17,34.55 88.63,34.55 98.79,37.09 93.71,37.09 91.17,37.09 88.63,37.09 96.25,37.09 93.71,39.62 91.17,39.62 88.63,39.62 93.71,42.16 91.17,42.16 88.63,42.16 86.09,42.16 91.17,44.7 88.63,44.7 86.09,44.7 93.71,44.7 98.79,47.24 93.71,47.24 91.17,47.24 88.63,47.24 86.09,47.24 96.25,47.24 98.79,49.78 93.71,49.78 91.17,49.78 96.25,49.78 98.79,52.33 93.71,52.33 91.17,52.33 96.25,52.33 88.63,49.78 86.09,52.33 86.09,49.78 88.63,52.33 63.23,38.35 58.15,38.35 60.69,38.35 45.45,38.35 47.99,38.35 50.53,38.35 40.37,38.35 37.83,38.35 35.29,38.35 53.07,38.35 55.61,38.35 42.91,38.35 63.23,40.9 58.15,40.9 55.61,40.9 53.07,40.9 60.69,40.9 45.45,40.9 47.99,40.9 50.53,40.9 40.37,40.9 37.83,40.9 35.29,40.9 42.91,40.9 45.45,43.44 47.99,43.44 50.53,43.44 40.37,43.44 37.83,43.44 35.29,43.44 42.91,43.44 63.23,43.44 58.15,43.44 55.61,43.44 53.07,43.44 60.69,43.44 91.17,65.03 93.71,65.03 96.25,65.03 88.63,65.03 91.17,67.56 93.71,67.56 96.25,67.56 88.63,67.56 98.79,54.87 96.25,54.87 98.79,57.41 96.25,57.41 98.79,59.94 96.25,59.94 96.25,62.48 86.09,67.56 86.09,65.03 75.93,16.77 75.93,14.23 86.09,54.87 88.63,54.87 91.17,54.87 93.71,54.87 93.71,57.41 93.71,59.94 93.71,62.48 91.17,62.48 88.63,62.48 86.09,62.48 86.09,59.94 86.09,57.41 93.71,32.01 91.17,32.01 91.17,29.47 93.71,29.47
Q1-C  (via drill 0.64)
  Top 0.406: R11.1 21.82,9.78 C4.2
  Top 1.27: T2.1 T1.1
  Top 1.524: 22.34,22.48 21.83,22.48
  Bottom 1.016: C4.2 C4.3 11.92,9.78 9.64,12.07 9.64,28.32 9.64,28.83 11.41,30.61 11.81,31 J11.2
  other vias: 18.78,22.48 20.81,22.48 20.81,24.51 20.81,26.29 20.81,28.32 20.81,30.1 20.81,32.13 17,32.13 17,30.1
  pour Top (no thermals): 12.43,29.47 18.14,29.47 18.14,21.84 24.88,21.84 24.88,28.83 23.86,28.83 21.32,31.37 21.32,33.91 12.43,33.91
  pour Bottom (no thermals): 12.43,29.47 18.14,29.47 18.14,21.84 25.13,21.84 25.13,28.83 23.86,28.83 21.32,31.37 21.32,33.91 12.43,33.91
Q1-G
  Top 0.406: 21.82,12.07 20.56,12.07 14.46,12.07 9.64,12.07 7.35,14.35 R10.2 | T3.3 22.59,12.84 21.82,12.07 | R11.2 21.82,11.3 21.82,12.07
  Top 1.422: T2.3 T1.3 T3.3
RESET  (via drill 0.3)
  Top 0.203: R6.1 C3.2 | v69.58,64.39 59.55,64.39 58.91,63.75 J9.5 | v50.28,54.23 49.51,54.23 48.5,55.25 46.21,55.25 45.09,56.37 U1.29 40.99,56.37 v40.88,56.26 | 39.99,49.01 R6.1 | v69.58,54.74 69.07,55.25 57.64,55.25 57.13,54.74 54.09,54.74 v53.58,54.23 | v40.88,53.98 40.88,50.67 40.12,49.91 R6.1
  Bottom 0.203: v69.58,64.39 v69.58,54.74 69.58,51.31 71.61,49.28 71.61,41.02 72.12,40.51 72.12,36.2 71.61,35.69 68.06,35.69 67.55,35.18 67.55,9.27 68.06,8.76 70.6,8.76 71.22,8.14 SW5.1 | v53.58,54.23 v50.28,54.23 | v40.88,56.26 v40.88,53.98
RX
  Top 0.203: U1.31 43.16,54.74 38.59,54.74 38.08,54.23 38.08,49.4 37.58,48.9 J2.2
  Top 0.305: U1.31 43.22,54.74
SC2  (via drill 0.3)
  Top 0.203: U1.10 52.53,54.77 52.82,54.48 52.82,54.23 52.82,53.98 53.32,53.47 53.83,53.47 54.59,54.23 57.39,54.23 57.9,54.74 66.28,54.74 v67.04,53.98 | v67.04,53.98 66.79,54.23 v67.04,53.98
  Bottom 0.203: J8.2 70.85,42.55 70.85,49.4 69.83,50.42 67.67,50.42 67.04,51.05 67.04,53.47 v67.04,53.98
SCK  (via drill 0.3)
  Top 0.203: 50.45,61.06 U1.17 50.28,64.7 TFT1.7 | TFT1.7 51.08,66.3 51.72,66.93 54.21,66.93 54.85,66.3 54.85,64.9 56.37,63.37 J9.3 | TFT1.7 51.08,65.45 | v66.79,65.15 58.66,65.15 v58.4,64.9
  Bottom 0.203: J8.3 73.39,38.74 73.39,40.26 74.66,41.53 74.66,47.63 74.66,63.88 74.66,64.52 74.03,65.15 v66.79,65.15 | v58.4,64.9 58.15,64.9 57.9,64.9 56.37,63.37 J9.3
SCL  (via drill 0.3)
  Top 0.203: v78.47,56.26 78.34,56.26 77.96,55.88 77.83,55.75 57.13,55.75 56.88,56.01 55.36,56.01 53.58,56.01 v53.32,55.75 53.45,55.88 | v50.28,55.75 46.72,55.75 45.45,57.02 43.34,57.02 U1.28
  Bottom 0.203: J7.3 v78.47,56.26 | v53.32,55.75 v50.28,55.75
SDI  (via drill 0.3)
  Top 0.203: v75.93,58.04 75.55,57.66 55.48,57.66 53.45,57.66 v53.32,57.53 | v50.28,57.79 43.37,57.79 U1.27
  Bottom 0.203: J7.4 v75.93,58.04 | v53.32,57.53 50.53,57.53 v50.28,57.79
SEL  (via drill 0.3)
  Top 0.203: U1.14 51.84,58.04 52.56,58.04 52.82,58.29 54.09,58.29 v72.12,58.29 | SW4.4 76.49,42.75 77.2,42.04 77.2,36.2 v77.2,35.18
  Bottom 0.203: SW4.4 SW4.3 73.26,50.3 72.12,51.44 v72.12,58.29 | v77.2,35.18 77.2,30.86 77.2,29.08 77.2,28.83 75.17,26.8 74.15,25.78 73.64,25.27 72.37,24 71.1,22.73 J6.5
START  (via drill 0.3)
  Top 0.203: R8.1 38.85,52.2 | 38.85,52.2 38.85,52.45 38.85,52.96 v39.86,53.98 | U1.25 40.37,59.56 39.86,59.06 v39.86,56.26 | N4.1 38.85,52.2
  Bottom 0.203: v39.86,53.98 v39.86,56.26
TEMP
  Top 0.203: R1.2 46.47,49.66 45.45,50.67 45.45,52.45 U1.2 45.48,53.5 46.72,54.74 48.24,54.74 49.01,53.98 49.26,53.72 49.39,53.59 50.4,53.59 50.91,53.09 50.91,51.05 52.18,49.78 54.21,49.78 54.34,49.66 54.85,49.15 54.85,48.39 55.1,48.13 57.64,48.13 57.9,48.39 57.9,48.64 57.9,48.9 58.02,49.02 60.31,49.02 60.94,49.02 J3.2
TFT-RESET
  Top 0.203: TFT1.4 43.42,65.46 43.42,64.14 43.42,63.88 45.45,61.85 45.45,61.09 U1.23
TX
  Top 0.203: U1.30 39.61,55.57 38.15,55.57 38.08,55.5 37.58,54.99 37.58,51.94 37.07,51.44 J2.3
UP  (via drill 0.3)
  Top 0.203: v77.2,57.28 54.09,57.28 53.83,57.02 53.7,56.9 52.94,56.9 52.82,57.02 52.69,57.15 51.79,57.15 U1.13 51.88,57.28 | SW3.4 73.26,25.65 72.63,25.02 J6.4 | SW3.3 74.91,34.25 75.25,34.25 v76.18,35.18
  Bottom 0.203: SW3.4 SW3.3 | v77.2,57.28 77.2,48.9 77.2,36.45 77.2,36.2 v76.18,35.18
VACUUM  (via drill 0.3)
  Top 0.203: v81.01,45.34 v83.8,45.34
  Bottom 0.203: J1.1 84.57,38.61 84.57,43.56 84.57,44.7 83.93,45.34 v83.8,45.34 | J7.2 v81.01,45.34

### Text on the board
tPlace: tStop! | no cream
tNames: 1 | 1 | www.avdweb.nl | GND | 1 | ISP | + | GND | + | FTDI | + | 3 | DS18B20 | 1 | 1 | 1 | vacuum / PCB | + | 1 | GND | MAX6675 PCB | 1 | vacuum | 1 | 1 | 1 | vacuum / sensor | OUT | + | MAINS | radius 0.025 | 1 | text 0.04 | HIGH VOLTAGE | Foot / Switch | UPC v3 | HIGH / VOLTAGE | 1
bNames: 1 | Universal AC / power control | DOWN | AC1 | AC2 | HIGH VOLTAGE | START | UP | SEL | HIGH VOLTAGE | RESET